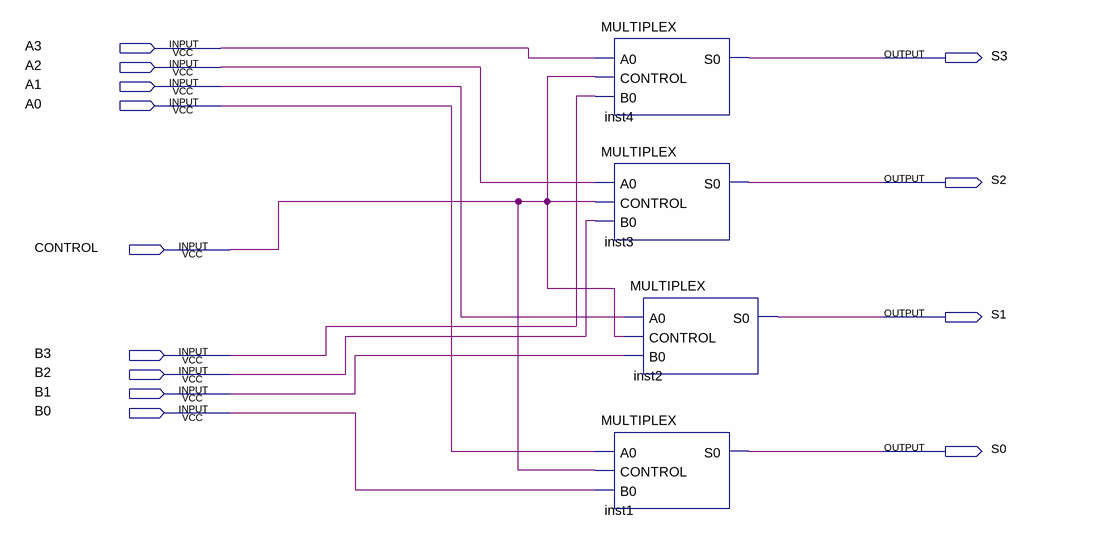
[diagram p0: schematic sheet]
// Quartus schematic MULPLEX4.bdf as structural Verilog: 4 symbols, 13 pins
module MULPLEX4 (
  input  A3,
  input  A2,
  input  A1,
  input  A0,
  input  CONTROL,
  input  B3,
  input  B2,
  input  B1,
  input  B0,
  output S3,
  output S2,
  output S1,
  output S0
);

  MULTIPLEX inst4 (.A0(A3), .CONTROL(CONTROL), .B0(B3), .S0(S3));
  MULTIPLEX inst3 (.A0(A2), .CONTROL(CONTROL), .B0(B2), .S0(S2));
  MULTIPLEX inst2 (.A0(A1), .CONTROL(CONTROL), .B0(B1), .S0(S1));
  MULTIPLEX inst1 (.A0(A0), .CONTROL(CONTROL), .B0(B0), .S0(S0));
endmodule
